# EAGLE design pi-wall-socket (EAGLE 9.6.2)
Pi Wall Socket: mains-powered Raspberry Pi Zero 2 W carrier for a wall-socket enclosure, with wired Ethernet (WIZ850io, SPI0) and Ethernet-over-powerline (PLC Stamp mini 2, SPI1)
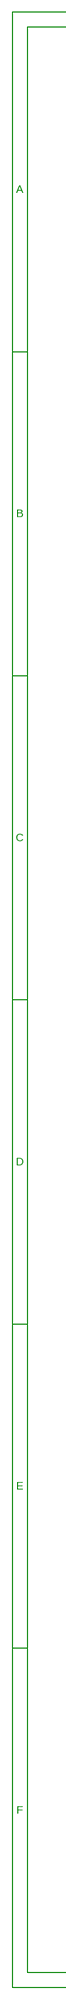
[diagram p0: schematic, sheet 1, part 1 of 2]
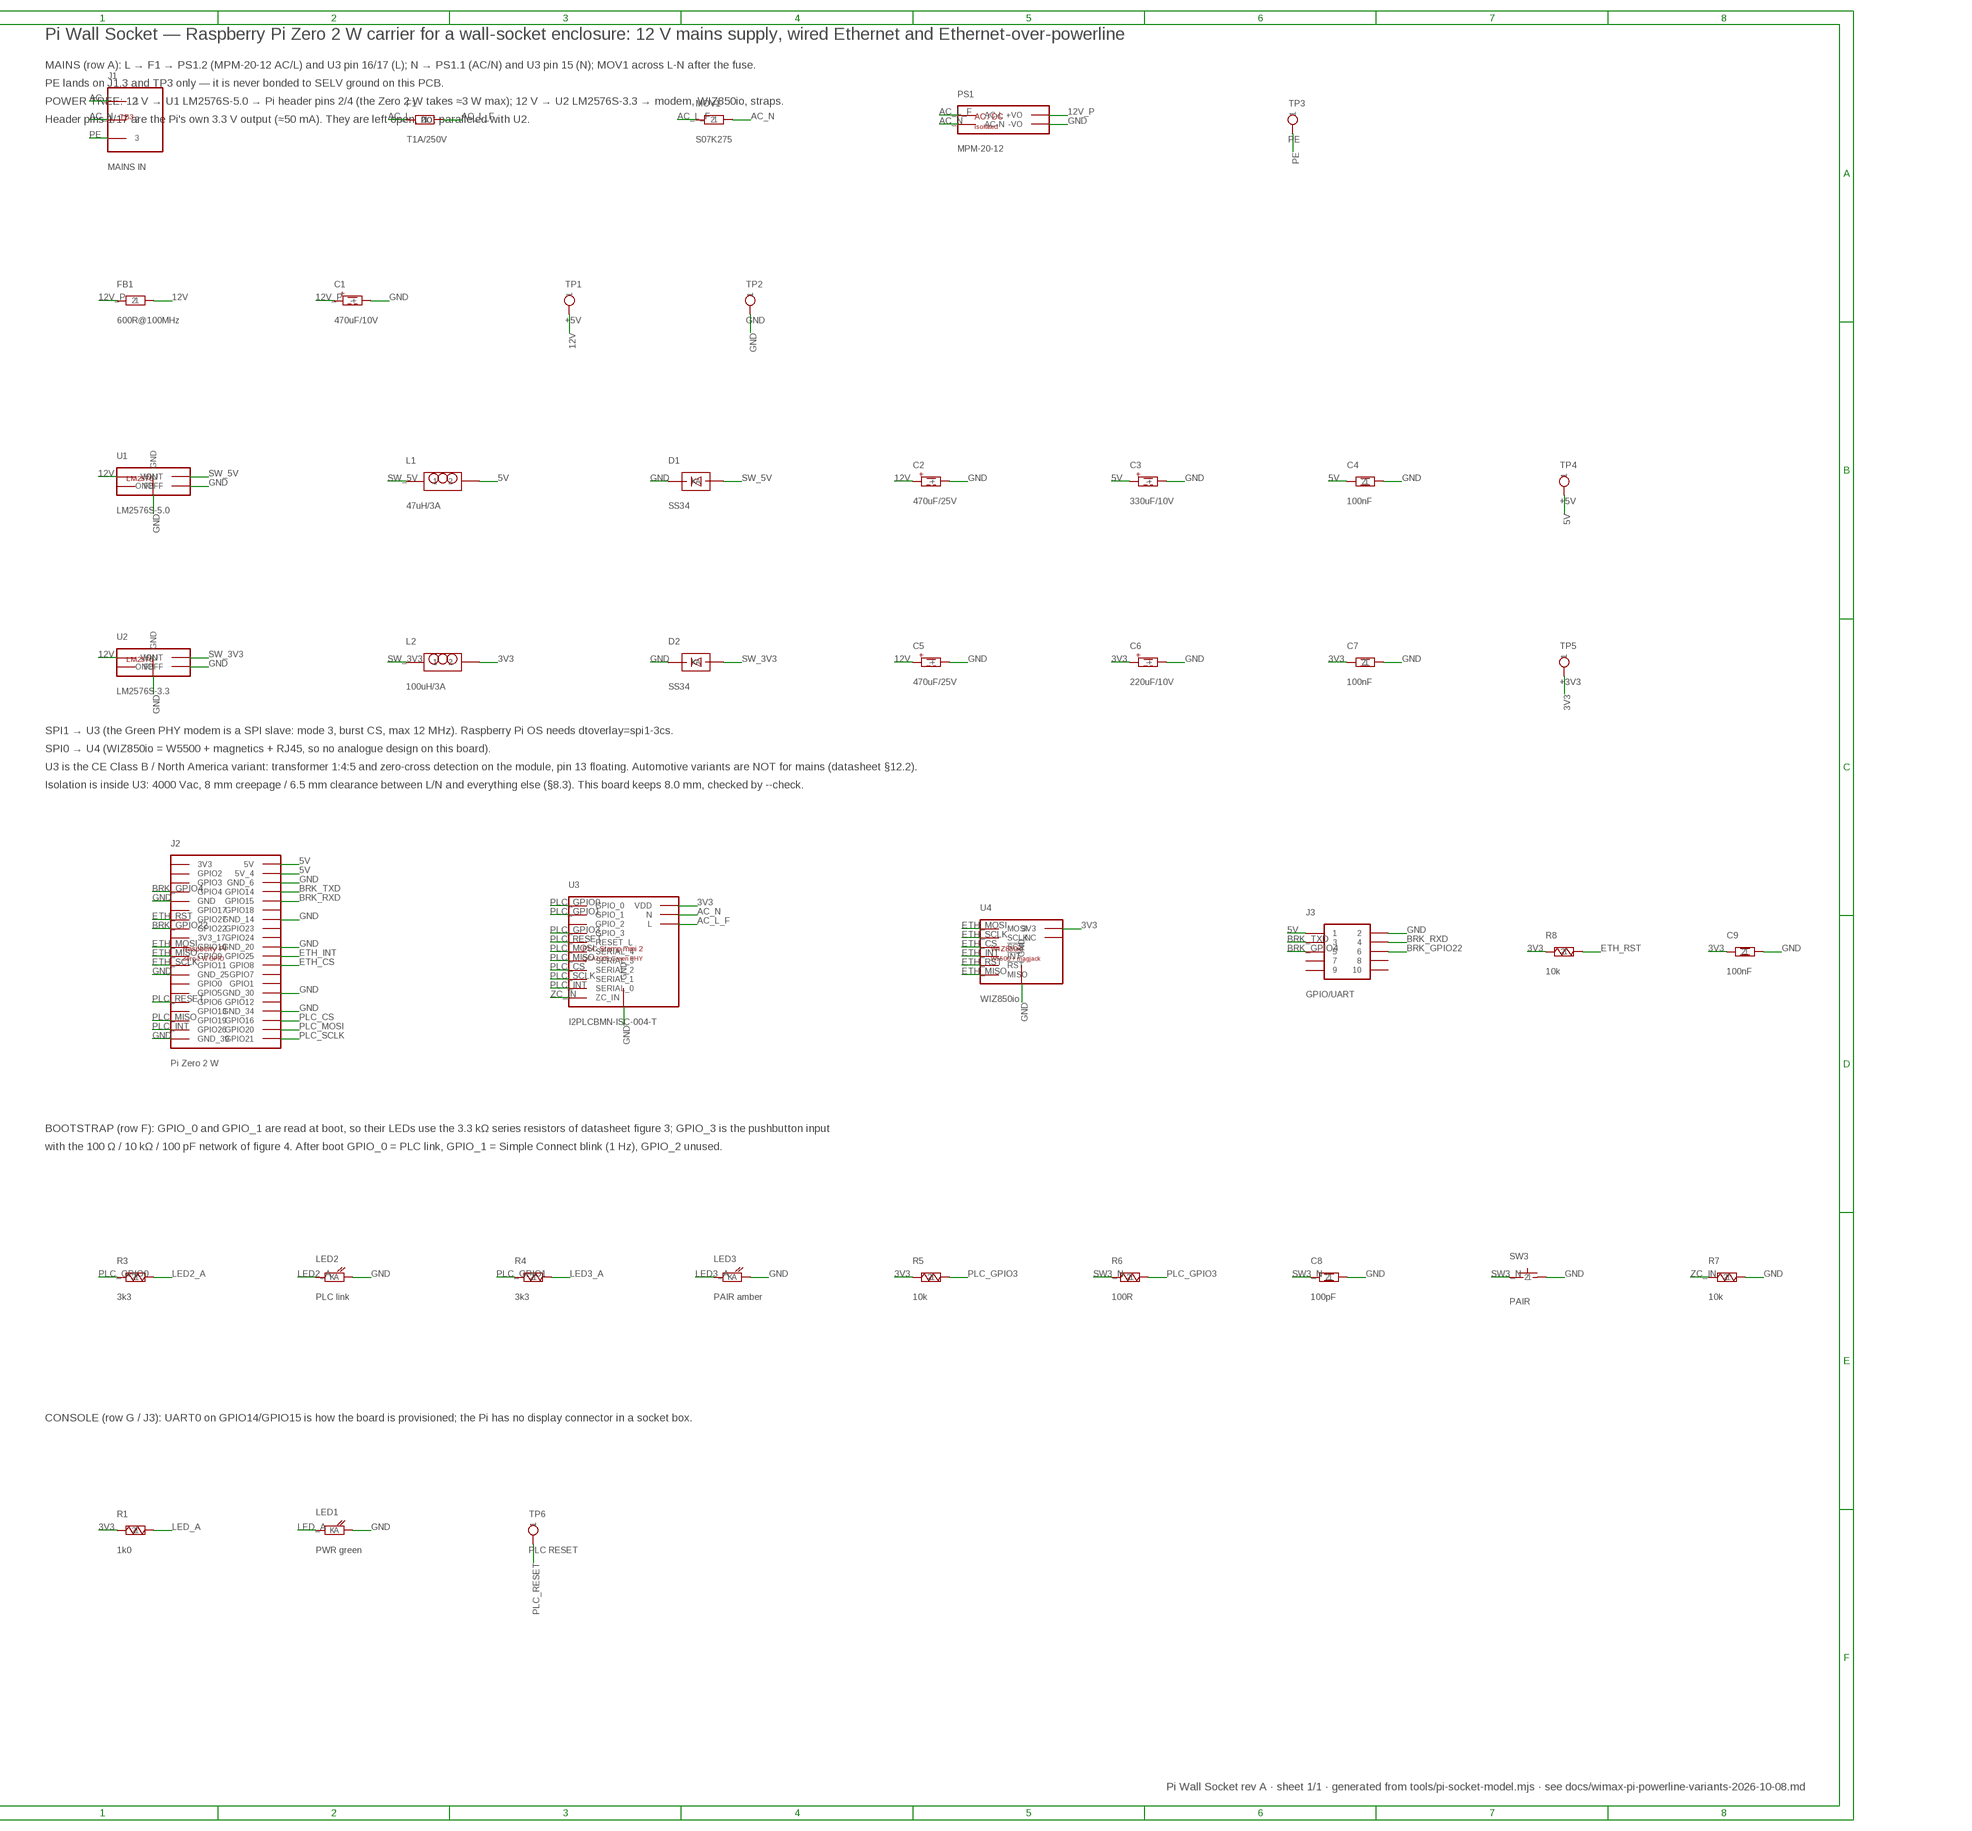
[diagram p1: schematic, sheet 1, part 2 of 2]

## Parts
C1  470uF/10V  CPOL-EU  [CP-D10-P5]
C2  470uF/25V  CPOL-EU  [CP-D10-P5]
C3  330uF/10V  CPOL-EU  [CP-D10-P5]
C4  100nF  C-0603  [C0603]
C5  470uF/25V  CPOL-EU  [CP-D10-P5]
C6  220uF/10V  CPOL-EU  [CP-D10-P5]
C7  100nF  C-0603  [C0603]
C8  100pF  C-EU  [C-5.08]
C9  100nF  C-0603  [C0603]
D1  SS34  DIODE-SCH  [DO41]
D2  SS34  DIODE-SCH  [DO41]
F1  T1A/250V  FUSE  [FUSE-RADIAL]
FB1  600R@100MHz  FERRITE  [FB-7.62]
J1  MAINS IN  TERM-3  [CUI_TB003]
J2  Pi Zero 2 W  PI-ZERO-SOCKET  [PIZERO]
J3  GPIO/UART  HDR-2X5  [HDR-2X5]
L1  47uH/3A  L-RADIAL  [LRAD12]
L2  100uH/3A  L-RADIAL  [LRAD12]
LED1  PWR green  LED  [LED-5MM]
LED2  PLC link  LED  [LED-5MM]
LED3  PAIR amber  LED  [LED-5MM]
MOV1  S07K275  MOV  [MOV07]
PS1  MPM-20-12  ACDC-12V  [MPM2012]
R1  1k0  R-EU  [R-7.62]
R3  3k3  R-EU  [R-7.62]
R4  3k3  R-EU  [R-7.62]
R5  10k  R-EU  [R-7.62]
R6  100R  R-EU  [R-7.62]
R7  10k  R-EU  [R-7.62]
R8  10k  R-EU  [R-7.62]
SW3  PAIR  SW-PUSH  [SW-TACT-6MM]
TP1  +5V  TP  [TP]
TP2  GND  TP  [TP]
TP3  PE  TP  [TP]
TP4  +5V  TP  [TP]
TP5  +3V3  TP  [TP]
TP6  PLC RESET  TP  [TP]
U1  LM2576S-5.0  BUCK-5V  [LM2576S]
U2  LM2576S-3.3  BUCK-3V3  [LM2576S]
U3  I2PLCBMN-ISC-004-T  PLC-STAMP-MINI-2  [PLCSTAMP]
U4  WIZ850io  WIZ850IO  [WIZ850IO]

## Nets
3V3 [power]: C6.+ C7.1 C9.1 L2.2 R1.1 R5.1 R8.1 TP5.1 U3.12(VDD) U4.8(3V3) U4.9(3V3)
5V [power]: C3.+ C4.1 J2.2(5V) J2.4(5V_4) J3.1 L1.2 TP4.1
12V [power]: C2.+ C5.+ FB1.2 TP1.1 U1.1(VIN) U2.1(VIN)
12V_P [power]: C1.+ FB1.1 PS1.3(+VO)
AC_L [mains]: F1.1 J1.1
AC_L_F [mains]: F1.2 MOV1.1 PS1.2(AC-L) U3.16(L) U3.17(L)
AC_N [mains]: J1.2 MOV1.2 PS1.1(AC-N) U3.15(N)
BRK_GPIO4: J2.7(GPIO4) J3.5
BRK_GPIO22: J2.15(GPIO22) J3.6
BRK_RXD: J2.10(GPIO15) J3.4
BRK_TXD: J2.8(GPIO14) J3.3
ETH_CS: J2.24(GPIO8) U4.5(!SCS)
ETH_INT: J2.22(GPIO25) U4.6(!INT)
ETH_MISO: J2.21(GPIO9) U4.12(MISO)
ETH_MOSI: J2.19(GPIO10) U4.3(MOSI)
ETH_RST: J2.13(GPIO27) R8.2 U4.11(!RST)
ETH_SCLK: J2.23(GPIO11) U4.4(SCLK)
GND [power]: C1.- C2.- C3.- C4.2 C5.- C6.- C7.2 C8.2 C9.2 D1.A D2.A J2.6(GND_6) J2.9(GND) J2.14(GND_14) J2.20(GND_20) J2.25(GND_25) J2.30(GND_30) J2.34(GND_34) J2.39(GND_39) J3.2 LED1.2(K) LED2.2(K) LED3.2(K) PS1.4(-VO) R7.2 SW3.2 TP2.1 U1.3(GND) U1.3_2(GND) U1.5(ONOFF) U1.P7(GND) U1.P8(GND) U1.P9(GND) U1.P10(GND) U2.3(GND) U2.3_2(GND) U2.5(ONOFF) U2.P7(GND) U2.P8(GND) U2.P9(GND) U2.P10(GND) U3.11(GND) U3.18(GND) U3.19(GND) U3.20(GND) U3.21(GND) U3.22(GND) U3.23(GND) U3.24(GND) U3.25(GND) U4.1(GND) U4.2(GND) U4.7(GND)
LED2_A: LED2.1(A) R3.2
LED3_A: LED3.1(A) R4.2
LED_A: LED1.1(A) R1.2
PE [mains]: J1.3 TP3.1
PLC_CS: J2.36(GPIO16) U3.8(SERIAL_2)
PLC_GPIO0: R3.1 U3.1(GPIO_0)
PLC_GPIO1: R4.1 U3.2(GPIO_1)
PLC_GPIO3: R5.2 R6.2 U3.4(GPIO_3)
PLC_INT: J2.37(GPIO26) U3.10(SERIAL_0)
PLC_MISO: J2.35(GPIO19) U3.7(SERIAL_3)
PLC_MOSI: J2.38(GPIO20) U3.6(SERIAL_4)
PLC_RESET: J2.31(GPIO6) TP6.1 U3.5(RESET_L)
PLC_SCLK: J2.40(GPIO21) U3.9(SERIAL_1)
SW3_N: C8.1 R6.1 SW3.1
SW_3V3 [power]: D2.K L2.1 U2.2(VOUT)
SW_5V [power]: D1.K L1.1 U1.2(VOUT)
ZC_IN: R7.1 U3.13(ZC_IN)
Unconnected: J2.1(3V3) J2.3(GPIO2) J2.5(GPIO3) J2.11(GPIO17) J2.12(GPIO18) J2.16(GPIO23) J2.17(3V3_17) J2.18(GPIO24) J2.26(GPIO7) J2.27(GPIO0) J2.28(GPIO1) J2.29(GPIO5) J2.32(GPIO12) J2.33(GPIO13) J3.7 J3.8 J3.9 J3.10 U1.4(FB) U2.4(FB) U3.3(GPIO_2) U4.10(NC)

## Notes on the sheet
- Pi Wall Socket — Raspberry Pi Zero 2 W carrier for a wall-socket enclosure: 12 V mains supply, wired Ethernet and Ethernet-over-powerline
- MAINS (row A): L → F1 → PS1.2 (MPM-20-12 AC/L) and U3 pin 16/17 (L); N → PS1.1 (AC/N) and U3 pin 15 (N); MOV1 across L-N after the fuse.
- PE lands on J1.3 and TP3 only — it is never bonded to SELV ground on this PCB.
- POWER TREE: 12 V → U1 LM2576S-5.0 → Pi header pins 2/4 (the Zero 2 W takes ≈3 W max); 12 V → U2 LM2576S-3.3 → modem, WIZ850io, straps.
- Header pins 1/17 are the Pi's own 3.3 V output (≈50 mA). They are left open, not paralleled with U2.
- SPI1 → U3 (the Green PHY modem is a SPI slave: mode 3, burst CS, max 12 MHz). Raspberry Pi OS needs dtoverlay=spi1-3cs.
- SPI0 → U4 (WIZ850io = W5500 + magnetics + RJ45, so no analogue design on this board).
- U3 is the CE Class B / North America variant: transformer 1:4:5 and zero-cross detection on the module, pin 13 floating. Automotive variants are NOT for mains (datasheet §12.2).
- Isolation is inside U3: 4000 Vac, 8 mm creepage / 6.5 mm clearance between L/N and everything else (§8.3). This board keeps 8.0 mm, checked by --check.
- BOOTSTRAP (row F): GPIO_0 and GPIO_1 are read at boot, so their LEDs use the 3.3 kΩ series resistors of datasheet figure 3; GPIO_3 is the pushbutton input
- with the 100 Ω / 10 kΩ / 100 pF network of figure 4. After boot GPIO_0 = PLC link, GPIO_1 = Simple Connect blink (1 Hz), GPIO_2 unused.
- CONSOLE (row G / J3): UART0 on GPIO14/GPIO15 is how the board is provisioned; the Pi has no display connector in a socket box.
- Pi Wall Socket rev A · sheet 1/1 · generated from tools/pi-socket-model.mjs · see docs/wimax-pi-powerline-variants-2026-10-08.md

## Library data of the parts
C1-C3 C5 C6 = pi-wall-socket:CPOL-EU
C4 C7 C9 = pi-wall-socket:C-0603
C8 = pi-wall-socket:C-EU
D1 D2 = pi-wall-socket:DIODE-SCH
F1 = pi-wall-socket:FUSE
FB1 = pi-wall-socket:FERRITE
J1 = pi-wall-socket:TERM-3
J2 = pi-wall-socket:PI-ZERO-SOCKET
J3 = pi-wall-socket:HDR-2X5
L1 L2 = pi-wall-socket:L-RADIAL
LED1-LED3 = pi-wall-socket:LED
MOV1 = pi-wall-socket:MOV
PS1 = pi-wall-socket:ACDC-12V
R1 R3-R8 = pi-wall-socket:R-EU
SW3 = pi-wall-socket:SW-PUSH
TP1-TP6 = pi-wall-socket:TP
U1 = pi-wall-socket:BUCK-5V
U2 = pi-wall-socket:BUCK-3V3
U3 = pi-wall-socket:PLC-STAMP-MINI-2
U4 = pi-wall-socket:WIZ850IO

## Net classes
0 default: width 0.305 mm
1 mains: width 2.5 mm, clearance 8 mm to class 0, clearance 8 mm, clearance 8 mm to class 2
2 power: width 1 mm, clearance 0.5 mm to class 0, clearance 0.6 mm

## Board
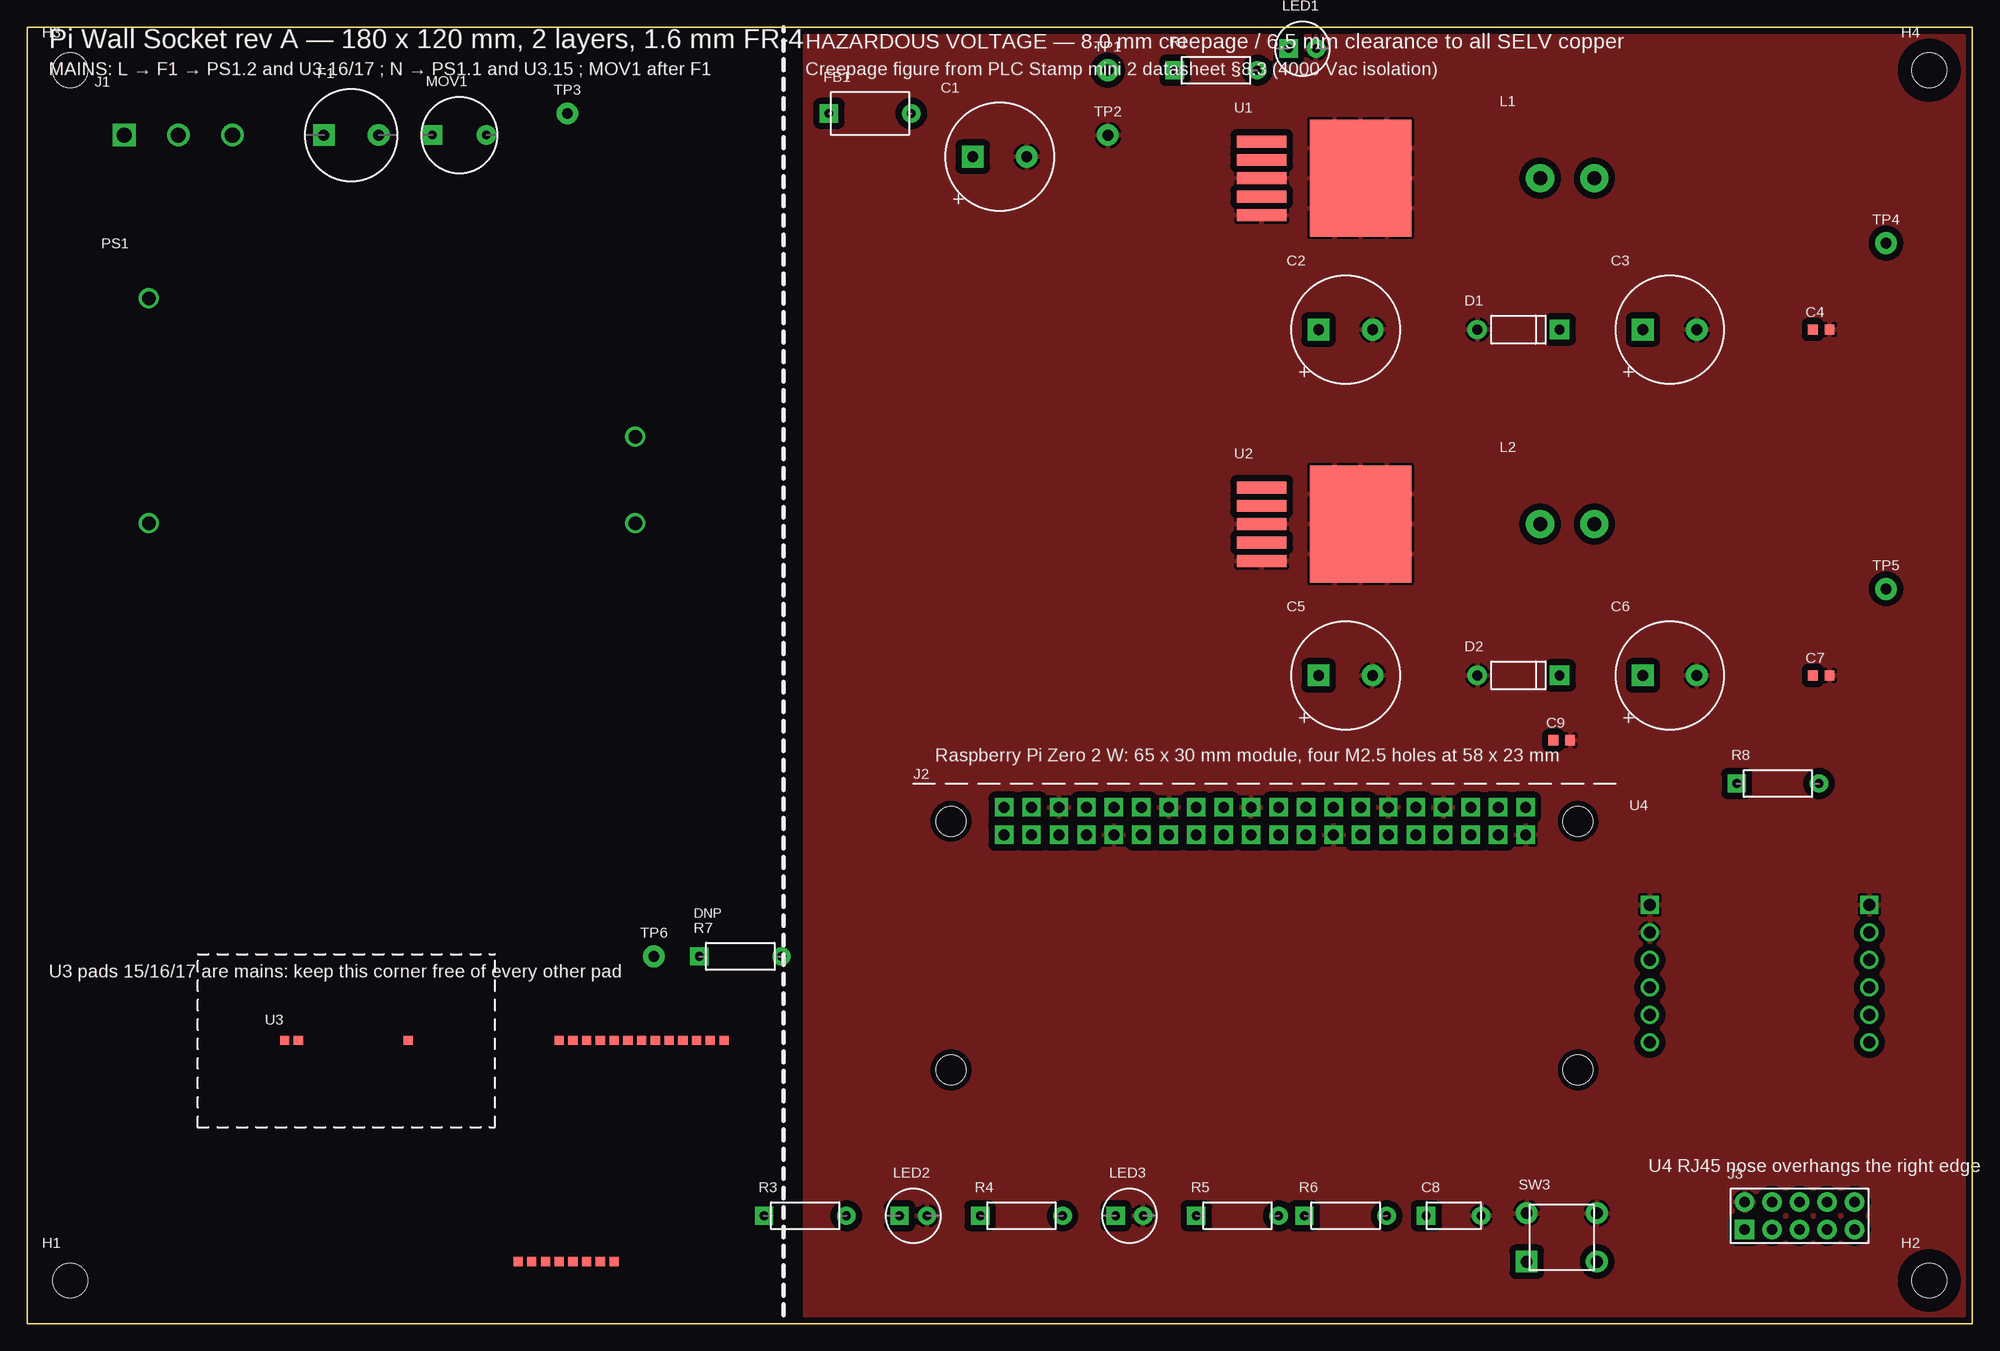
[diagram p2: board, top side]
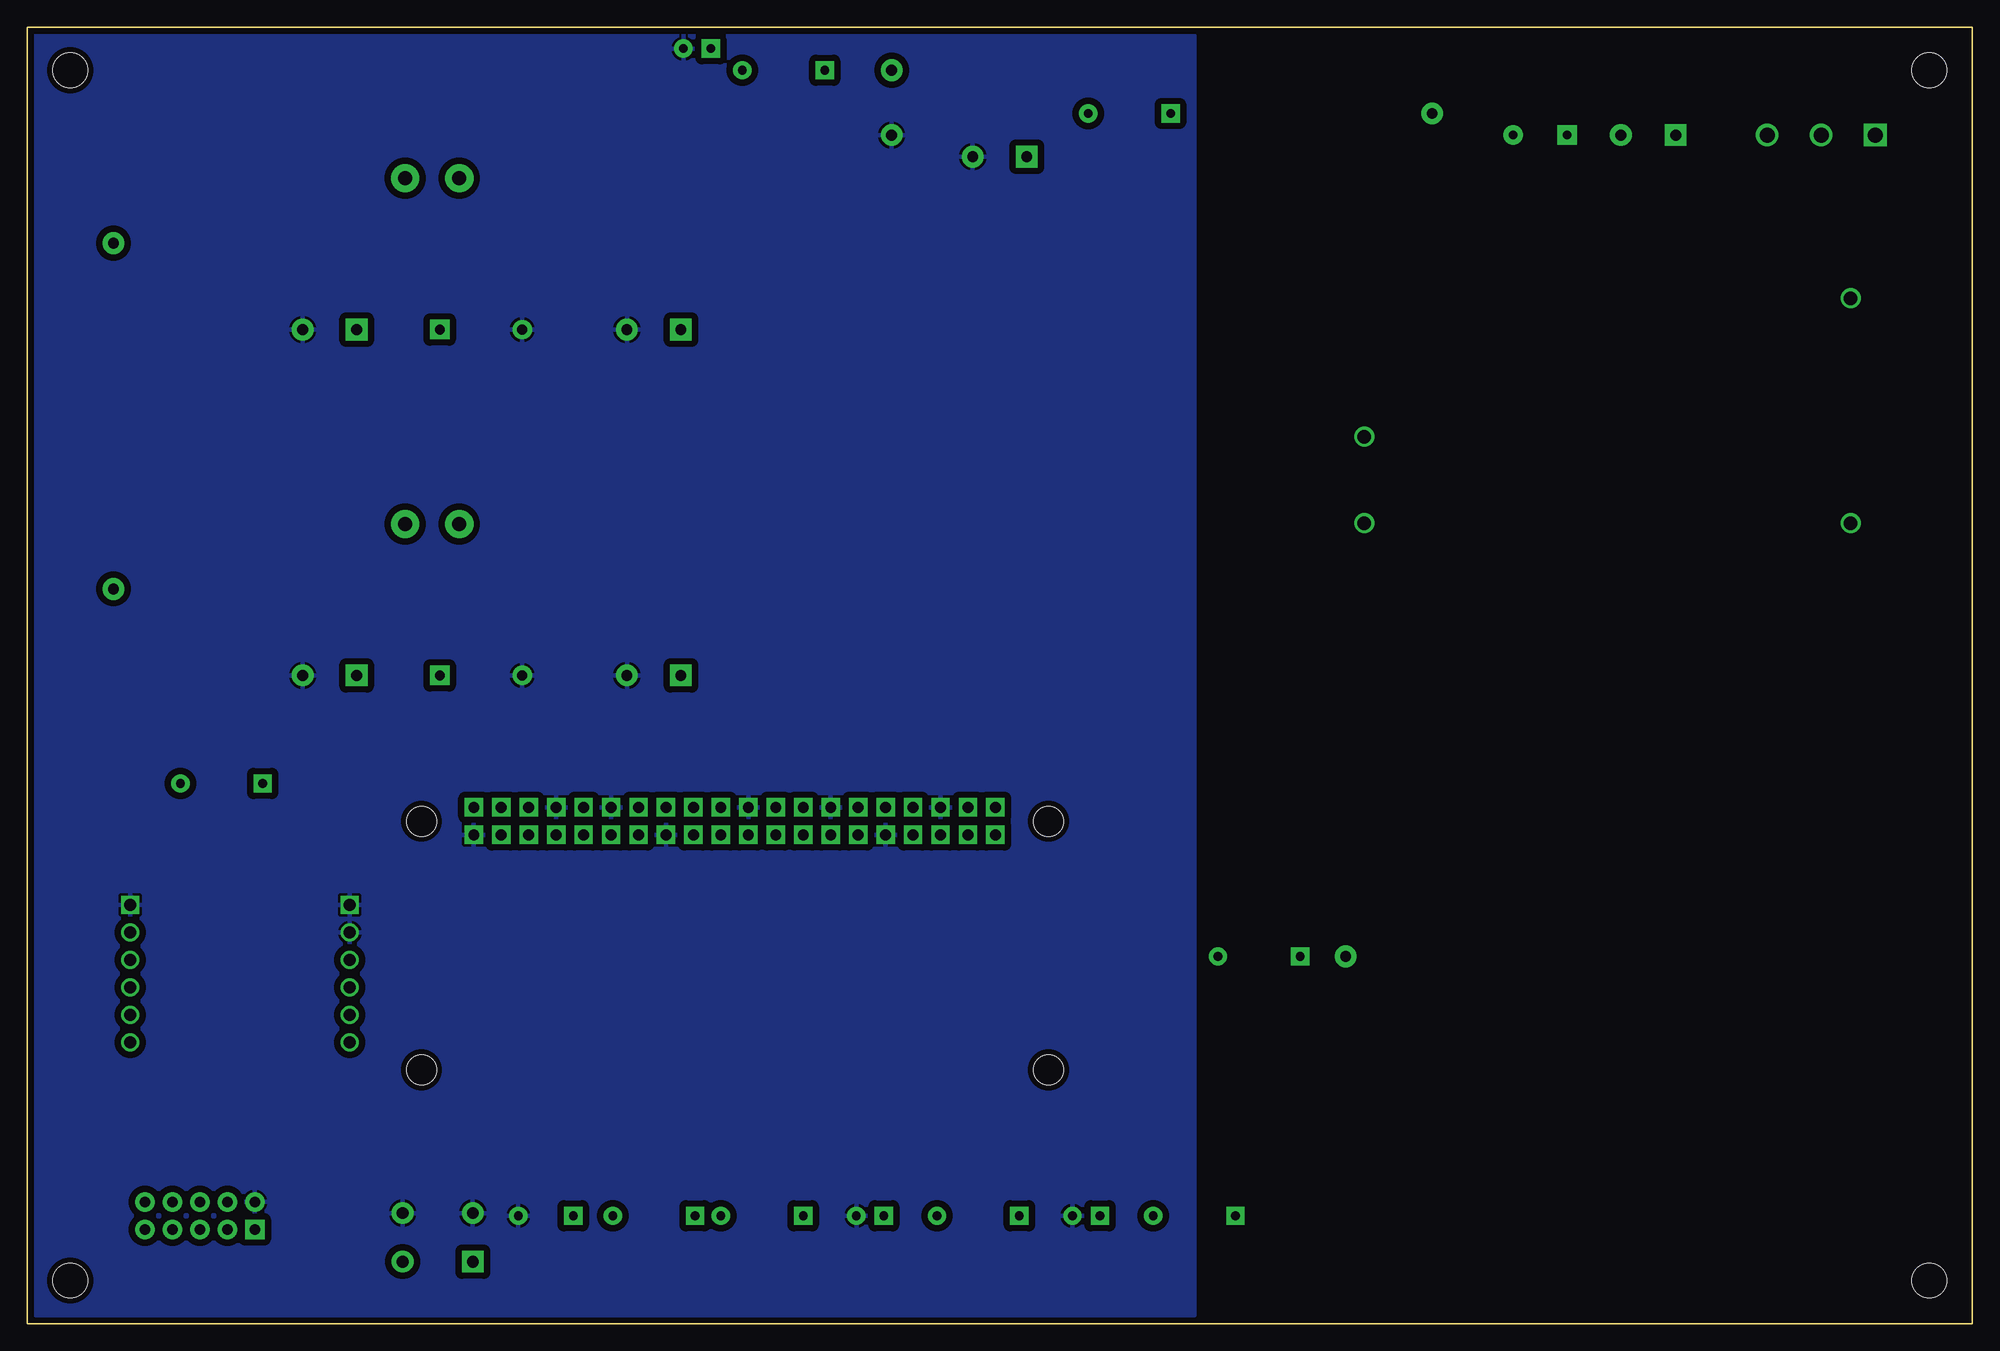
[diagram p3: board, bottom side, seen from below]

Size 180 x 120 mm. Coordinates in mm from the lower left corner, seen from the top.
Outline: 0,0 180,0 180,120 0,120 0,0
Copper layers (1*16): Top 0.035mm / dielectric 1.5mm / Bottom 0.035mm
Design rules "pi-wall-socket-2layer": minimum track width 8mil, minimum drill 0.35mm, track to track 8mil, track to pad 8mil, pad to pad 8mil, via to via 8mil, smd to smd 0mil, copper to edge 20mil, drill to drill 8mil, minimum pad ring 10mil, minimum via ring 8mil, stop-mask expansion 4mil, vias tented up to drill 25mil, thermal gap 10mil
tRestrict: 2 lines

### Footprints (pad centres in the part's own frame; a part is rotated, then mirrored left to right if it is on the bottom)
CP-D10-P5 = drill 1 pad 2 square: + -2.5,0 | drill 1 pad 2: - 2.5,0
C0603 = smd 0.9 x 0.95: 1 -0.775,0; 2 0.775,0
C-5.08 = drill 0.8 pad 1.7 square: 1 -2.54,0 | drill 0.8 pad 1.7: 2 2.54,0
DO41 = drill 0.9 pad 1.8: A -3.81,0 | drill 0.9 pad 1.8 square: K 3.81,0
FUSE-RADIAL = drill 1 pad 2 square: 1 -2.54,0 | drill 1 pad 2: 2 2.54,0
FB-7.62 = drill 0.8 pad 1.7 square: 1 -3.81,0 | drill 0.8 pad 1.7: 2 3.81,0
MOUNT-M3 = hole 3.2: 0,0
CUI_TB003 = drill 1.4 pad 2.1 square: 1 -5,0 | drill 1.4 pad 2.1: 2 0,0; 3 5,0
PIZERO = drill 1 pad 1.7 square: 1 8.4,25.25; 2 8.4,27.79; 3 10.94,25.25; 4 10.94,27.79; 5 13.48,25.25; 6 13.48,27.79; 7 16.02,25.25; 8 16.02,27.79; 9 18.56,25.25; 10 18.56,27.79; 11 21.1,25.25; 12 21.1,27.79; 13 23.64,25.25; 14 23.64,27.79; 15 26.18,25.25; 16 26.18,27.79; 17 28.72,25.25; 18 28.72,27.79; 19 31.26,25.25; 20 31.26,27.79; 21 33.8,25.25; 22 33.8,27.79; 23 36.34,25.25; 24 36.34,27.79; 25 38.88,25.25; 26 38.88,27.79; 27 41.42,25.25; 28 41.42,27.79; 29 43.96,25.25; 30 43.96,27.79; 31 46.5,25.25; 32 46.5,27.79; 33 49.04,25.25; 34 49.04,27.79; 35 51.58,25.25; 36 51.58,27.79; 37 54.12,25.25; 38 54.12,27.79; 39 56.66,25.25; 40 56.66,27.79 | hole 2.75: 61.5,3.5; 61.5,26.5; 3.5,26.5; 3.5,3.5
HDR-2X5 = drill 1 pad 1.8 square: 1 -5.08,-1.27 | drill 1 pad 1.8: 2 -5.08,1.27; 3 -2.54,-1.27; 4 -2.54,1.27; 5 0,-1.27; 6 0,1.27; 7 2.54,-1.27; 8 2.54,1.27; 9 5.08,-1.27; 10 5.08,1.27
LRAD12 = drill 1.3 pad 2.6: 1 0,0; 2 5,0
LED-5MM = drill 0.8 pad 1.7 square: 1 -1.27,0 | drill 0.8 pad 1.7: 2 1.27,0
MOV07 = drill 0.8 pad 1.8 square: 1 -2.5,0 | drill 0.8 pad 1.8: 2 2.5,0
MPM2012 = drill 1.24 pad 1.86: 1 22.733,9.906; 2 22.733,-10.894; 3 -22.267,1.906; 4 -22.267,9.906
R-7.62 = drill 0.8 pad 1.7 square: 1 -3.81,0 | drill 0.8 pad 1.7: 2 3.81,0
SW-TACT-6MM = drill 1.1 pad 2 square: 1 -3.25,-2.25 | drill 1.1 pad 2: 1 3.25,-2.25; 2 -3.25,2.25; 2 3.25,2.25
TP = drill 1 pad 2: 1 0,0
LM2576S = smd 4.6 x 1.1: 1 -5.775,3.4; 2 -5.775,1.7; 3 -5.775,0; 4 -5.775,-1.7; 5 -5.775,-3.4 | smd 9.4 x 10.8: 3_2 3.375,0 | smd 4.55 x 5.25: P7 5.8,-2.775; P8 0.95,2.775; P9 5.8,2.775; P10 0.95,-2.775
PLCSTAMP = smd 0.85 x 0.85: 1 20.48,10.235; 2 19.21,10.235; 3 17.94,10.235; 4 16.67,10.235; 5 15.4,10.235; 6 14.13,10.235; 7 12.86,10.235; 8 11.59,10.235; 9 10.32,10.235; 10 9.05,10.235; 11 7.78,10.235; 12 6.51,10.235; 13 5.24,10.235; 15 -8.73,10.235; 16 -18.89,10.235; 17 -20.16,10.235; 18 1.43,-10.235; 19 2.7,-10.235; 20 3.97,-10.235; 21 5.24,-10.235; 22 6.51,-10.235; 23 7.78,-10.235; 24 9.05,-10.235; 25 10.32,-10.235
WIZ850IO = drill 1.12 pad 1.68 square: 1 -9.86,4.75; 7 10.46,4.75 | drill 1.12 pad 1.68: 2 -9.86,2.21; 3 -9.86,-0.33; 4 -9.86,-2.87; 5 -9.86,-5.41; 6 -9.86,-7.95; 8 10.46,2.21; 9 10.46,-0.33; 10 10.46,-2.87; 11 10.46,-5.41; 12 10.46,-7.95

### Placement (x,y rotation side)
C1  90,108 0 top
C2  122,92 0 top
C3  152,92 0 top
C4  166,92 0 top
C5  122,60 0 top
C6  152,60 0 top
C7  166,60 0 top
C8  132,10 0 top
C9  142,54 0 top
D1  138,92 0 top
D2  138,60 0 top
F1  30,110 0 top
FB1  78,112 0 top
H1  [MOUNT-M3]  4,4 0 top
H2  [MOUNT-M3]  176,4 0 top
H3  [MOUNT-M3]  4,116 0 top
H4  [MOUNT-M3]  176,116 0 top
J1  14,110 0 top
J2  82,20 0 top
J3  164,10 0 top
L1  140,106 0 top
L2  140,74 0 top
LED1  118,118 0 top
LED2  82,10 0 top
LED3  102,10 0 top
MOV1  40,110 0 top
PS1  34,84 180 top
R1  110,116 0 top
R3  72,10 0 top
R4  92,10 0 top
R5  112,10 0 top
R6  122,10 0 top
R7  66,34 0 top
R8  162,50 0 top
SW3  142,8 0 top
TP1  100,116 0 top
TP2  100,110 0 top
TP3  50,112 0 top
TP4  172,100 0 top
TP5  172,68 0 top
TP6  58,34 0 top
U1  120,106 0 top
U2  120,74 0 top
U3  44,16 0 top
U4  160,34 0 top

### Tracks (layer width: path | path; a pad name or v marks a point on that pad's centre or on a via)
GND
  pour Top (isolate 0.4, rank 2): 72,0.8 179.2,0.8 179.2,119.2 72,119.2
  pour Bottom (isolate 0.4, rank 2): 72,0.8 179.2,0.8 179.2,119.2 72,119.2

### Text on the board
tPlace: Pi Wall Socket rev A — 180 x 120 mm, 2 layers, 1.6 mm FR-4 | HAZARDOUS VOLTAGE — 8.0 mm creepage / 6.5 mm clearance to all SELV copper | MAINS: L → F1 → PS1.2 and U3.16/17 ; N → PS1.1 and U3.15 ; MOV1 after F1 | Creepage figure from PLC Stamp mini 2 datasheet §8.3 (4000 Vac isolation) | Raspberry Pi Zero 2 W: 65 x 30 mm module, four M2.5 holes at 58 x 23 mm | U3 pads 15/16/17 are mains: keep this corner free of every other pad | U4 RJ45 nose overhangs the right edge